# Altium schematic sheet blds.SchDoc
size A2
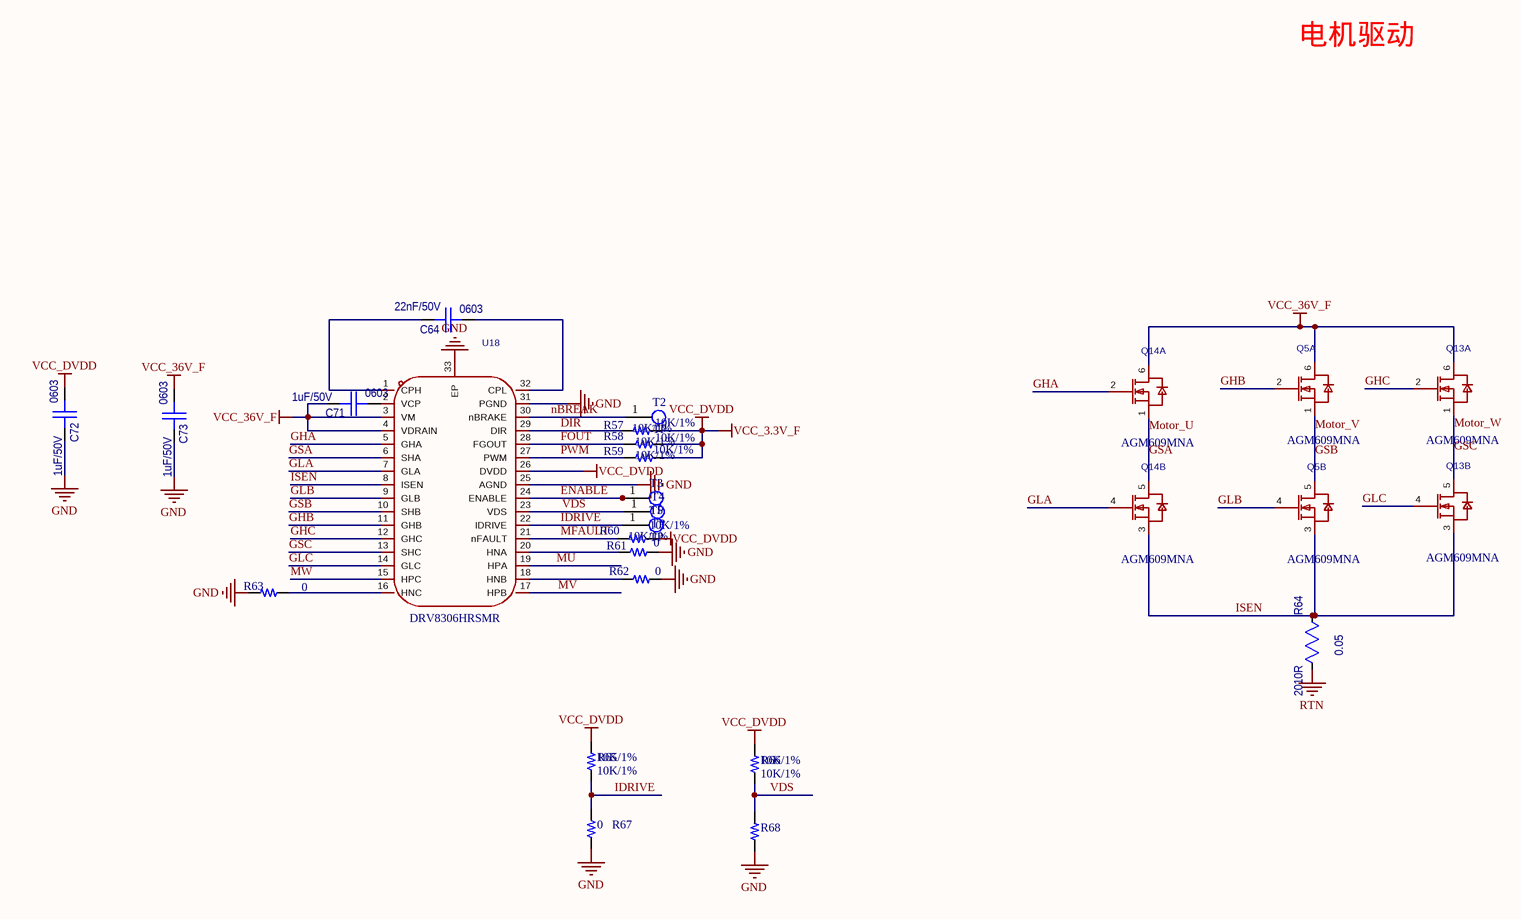
[diagram p0: blds.SchDoc]

## Parts
C64  22nF/50V  Package: 0603  [0603c]
C71  1uF/50V  Package: 0603  [0603C]
C72  1uF/50V  Package: 0603  [0603C]
C73  1uF/50V  Package: 0603  [0603C]
Q5  AGM609MNA  [DFN-8_L5.5-W5.2-P1.27-LS6.0-BL-EP2]  (parts A,B of 2)
Q13  AGM609MNA  [DFN-8_L5.5-W5.2-P1.27-LS6.0-BL-EP2]  (parts A,B of 2)
Q14  AGM609MNA  [DFN-8_L5.5-W5.2-P1.27-LS6.0-BL-EP2]  (parts A,B of 2)
R57  10K/1%  [0603R]
R58  10K/1%  [0603R]
R59  10K/1%  [0603R]
R60  10K/1%  [0603R]
R61  0  [0603R]
R62  0  [0603R]
R63  0  [0603R]
R64  0.05  [2010R]
R65  10K/1%  [0603R]
R66  10K/1%  [0603R]
R67  0  [0603R]
R68  0  [0603R]  (value not drawn)
T2  TP  [TPd]
T3  TP  [TPd]
T4  TP  [TPd]
T5  TP  [TPd]
U18  DRV8306HRSMR  [VQFN-32_L4.0-W4.0-P0.40-BL-EP]

## Nets
GND: C72.2 C73.2 R61.2 R62.2 R63.2 R67.2 R68.2 U18.25(AGND) U18.31(PGND) U18.33(EP)
RTN: R64.1
VCC_3.3V_F: C72.1 R57.2 R58.2 R59.2 R60.2 R65.1 R66.1 U18.26(DVDD)  [also labelled VCC_DVDD]
VCC_36V_F: C71.2 C73.1 Q5.6(D1) Q13.6(D1) Q14.6(D1) U18.3(VM) U18.4(VDRAIN)
DIR: R57.1 U18.29(DIR)
ENABLE: T3.1 U18.24(ENABLE)
FOUT: R58.1 U18.28(FGOUT)
GHA: Q14.2(G1) U18.5(GHA)
GHB: Q5.2(G1) U18.11(GHB)
GHC: Q13.2(G1) U18.12(GHC)
GLA: Q14.4(G2) U18.7(GLA)
GLB: Q5.4(G2) U18.9(GLB)
GLC: Q13.4(G2) U18.14(GLC)
GSA: Q14.1(S1) Q14.5(D2) U18.6(SHA)  [also labelled Motor_U]
GSB: Q5.1(S1) Q5.5(D2) U18.10(SHB)  [also labelled Motor_V]
GSC: Q13.1(S1) Q13.5(D2) U18.13(SHC)  [also labelled Motor_W]
IDRIVE: R65.2 R67.1 T5.1 U18.22(IDRIVE)
ISEN: Q5.3(S2) Q13.3(S2) Q14.3(S2) R64.2 U18.8(ISEN)
MFAULT: R60.1 U18.21(nFAULT)
MU: U18.19(HPA)
MV: U18.17(HPB)
MW: U18.15(HPC)
nBREAK: T2.1 U18.30(nBRAKE)
PWM: R59.1 U18.27(PWM)
VDS: R66.2 R68.1 T4.1 U18.23(VDS)
NetC64_1: C64.1 U18.32(CPL)
NetC64_2: C64.2 U18.1(CPH)
NetC71_1: C71.1 U18.2(VCP)
NetR61_1: R61.1 U18.20(HNA)
NetR62_1: R62.1 U18.18(HNB)
NetR63_1: R63.1 U18.16(HNC)

## Notes on the sheet
- 电机驱动

## Library data of the parts
C64 C71-C73 = Capacitor_0603: Capacitor, MLCC; Voltage Rating: [voltage]
  C64: Value: 22nF/50V
  C71-C73: Value: 1uF/50V
R57-R63 R65-R68 = R: Package: 0603
  R57-R60 R65 R66: Value: 10K/1%
  R61-R63 R67 R68: Value: 0
R64 = Resistor_0603: Resistor, Standard; Package: 2010R; Value: 0.05
Q5 Q13 Q14 = AGM609MNA: Package: DFN-8_L5.5-W5.2-P1.27-LS6.0-BL-EP2
U18 = DRV8306HRSMR: Package: VQFN-32_L4.0-W4.0-P0.40-BL-EP